# EAGLE design so08b (EAGLE 6.6.0)
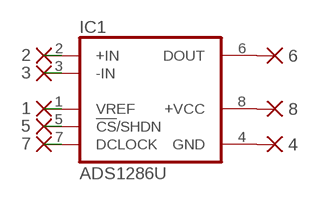
[diagram p0: schematic, sheet 1]

## Parts
1  PAD-0360  [0360]
2  PAD-0360  [0360]
3  PAD-0360  [0360]
4  PAD-0360  [0360]
5  PAD-0360  [0360]
6  PAD-0360  [0360]
7  PAD-0360  [0360]
8  PAD-0360  [0360]
IC1  ADS1286U  [SO08]

## Nets
N$1: 8.P$1(P) IC1.8(+VCC)
N$2: 7.P$1(P) IC1.7(DCLOCK)
N$3: 5.P$1(P) IC1.5(!CS!/SHDN)
N$4: 1.P$1(P) IC1.1(VREF)
N$5: 2.P$1(P) IC1.2(+IN)
N$6: 3.P$1(P) IC1.3(-IN)
N$7: 4.P$1(P) IC1.4(GND)
N$8: 6.P$1(P) IC1.6(DOUT)

## Library data of the parts
1-8 = dpads:PAD: WIRE PAD Standard US Drill Sizes
IC1 = burr-brown:ADS1286: 12-Bit Micro Power Sampling ADC; MF: TEXAS INSTRUMENTS; MPN: ADS1286U; OC_FARNELL: 1106203; OC_NEWARK: 80K5544

## Net classes
0 default: width 0.61 mm, clearance 0.508 mm

## Board
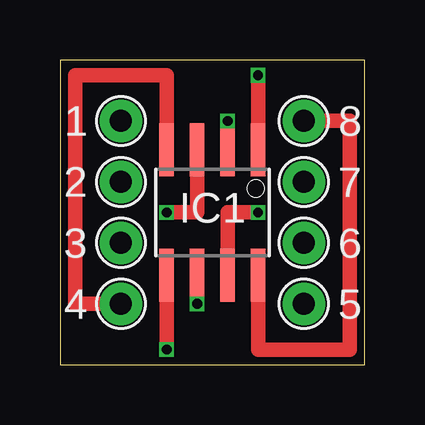
[diagram p1: board, top side]
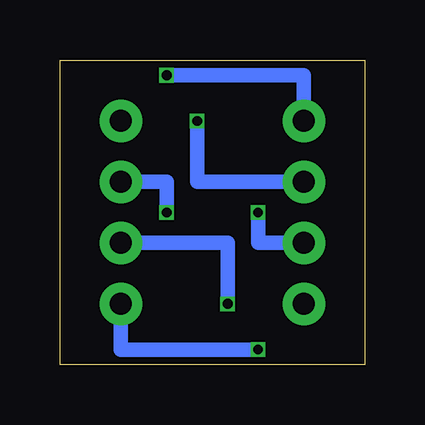
[diagram p2: board, bottom side, seen from below]

Size 12.7 x 12.7 mm. Coordinates in mm from the lower left corner, seen from the top.
Outline: 0,0 12.7,0 12.7,12.7 0,12.7 0,0
Copper layers (1*16): Top 0.035mm / dielectric 1.5mm / Bottom 0.035mm
Design rules "default": minimum track width 10mil, minimum drill 16mil, track to track 24mil, track to pad 24mil, pad to pad 24mil, via to via 24mil, smd to smd 0mil, copper to edge 10mil, drill to drill 8mil, minimum pad ring 10mil, minimum via ring 4mil, stop-mask expansion 4mil, vias tented up to drill 0mil, thermal gap 10mil

### Footprints (pad centres in the part's own frame; a part is rotated, then mirrored left to right if it is on the bottom)
0360 = drill 0.914 pad 1.778: P$1 0,0
SO08 = smd 0.61 x 2.21: 1 -1.905,-2.616; 2 -0.635,-2.616; 3 0.635,-2.616; 4 1.905,-2.616; 5 1.905,2.616; 6 0.635,2.616; 7 -0.635,2.616; 8 -1.905,2.616

### Placement (x,y rotation side)
1  2.54,10.16 0 top
2  2.54,7.62 0 top
3  2.54,5.08 0 top
4  2.54,2.54 0 top
5  10.16,2.54 0 top
6  10.16,5.08 0 top
7  10.16,7.62 0 top
8  10.16,10.16 0 top
IC1  6.35,6.35 180 top

### Tracks (layer width: path | path; a pad name or v marks a point on that pad's centre or on a via)
N$1
  Top 0.61: IC1.8 8.26,0.64 12.06,0.64 12.06,10.16 8.P$1
N$2  (via drill 0.41)
  Top 0.61: IC1.7 6.99,6.35 v8.26,6.35
  Bottom 0.61: v8.26,6.35 8.26,7.62 7.P$1
N$3  (via drill 0.41)
  Top 0.61: v4.45,0.64 IC1.5
  Bottom 0.61: v4.45,0.64 10.16,0.64 5.P$1
N$4  (via drill 0.41)
  Top 0.61: v8.26,12.06 IC1.1
  Bottom 0.61: 1.P$1 2.54,12.06 v8.26,12.06
N$5  (via drill 0.41)
  Top 0.61: v6.99,10.16 IC1.2
  Bottom 0.61: 2.P$1 6.99,7.62 v6.99,10.16
N$6  (via drill 0.41)
  Top 0.61: v4.45,6.35 5.71,6.35 IC1.3
  Bottom 0.61: 3.P$1 4.45,5.08 v4.45,6.35
N$7
  Top 0.61: 4.P$1 0.64,2.54 0.64,12.06 4.45,12.06 IC1.4 4.45,8.89
N$8  (via drill 0.41)
  Top 0.61: IC1.6 v5.71,2.54
  Bottom 0.61: 6.P$1 5.71,5.08 v5.71,2.54